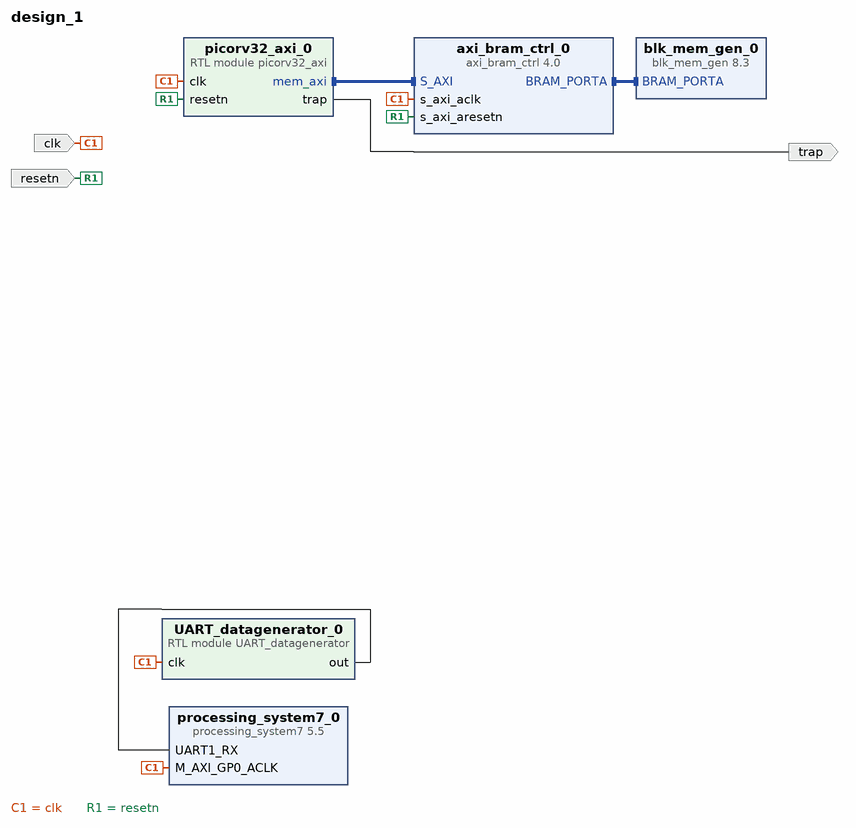
[diagram p0: block diagram of the top level]
# Vivado block design design_1, xc7z020clg484-1, Vivado 2017.2
create_bd_design design_1

create_bd_port -dir I -type clk clk
set_property -dict {CONFIG.FREQ_HZ 100000000} [get_bd_ports clk]
create_bd_port -dir I -type rst resetn
create_bd_port -dir O trap

create_bd_cell -type module -reference picorv32_axi picorv32_axi_0
set_property -dict {CONFIG.ENABLE_IRQ_QREGS 0 CONFIG.ENABLE_IRQ_TIMER 0} [get_bd_cells picorv32_axi_0]
create_bd_cell -type ip -vlnv xilinx.com:ip:blk_mem_gen:8.3 blk_mem_gen_0
set_property -dict [list \
  CONFIG.Enable_32bit_Address false \
  CONFIG.Use_Byte_Write_Enable false \
  CONFIG.Write_Width_A 32 \
  CONFIG.Read_Width_A 32 \
  CONFIG.Register_PortA_Output_of_Memory_Primitives true \
  CONFIG.Use_RSTA_Pin false \
  CONFIG.use_bram_block Stand_Alone \
] [get_bd_cells blk_mem_gen_0]
create_bd_cell -type ip -vlnv xilinx.com:ip:axi_bram_ctrl:4.0 axi_bram_ctrl_0
set_property -dict {CONFIG.PROTOCOL AXI4LITE CONFIG.SINGLE_PORT_BRAM 1} [get_bd_cells axi_bram_ctrl_0]
create_bd_cell -type ip -vlnv xilinx.com:ip:processing_system7:5.5 processing_system7_0
set_property -dict {CONFIG.PCW_UART1_PERIPHERAL_ENABLE 1 CONFIG.PCW_UART1_UART1_IO EMIO} [get_bd_cells processing_system7_0]
# 1 more settings of processing_system7_0 are not shown: defaults, MIO pin electricals, DDR timing, and values the tool derives
create_bd_cell -type module -reference UART_datagenerator UART_datagenerator_0

# ---- connections ----

connect_bd_intf_net [get_bd_intf_pins axi_bram_ctrl_0/BRAM_PORTA] [get_bd_intf_pins blk_mem_gen_0/BRAM_PORTA]
connect_bd_intf_net [get_bd_intf_pins axi_bram_ctrl_0/S_AXI] [get_bd_intf_pins picorv32_axi_0/mem_axi]
connect_bd_net [get_bd_ports clk] \
  [get_bd_pins picorv32_axi_0/clk] [get_bd_pins axi_bram_ctrl_0/s_axi_aclk] [get_bd_pins processing_system7_0/M_AXI_GP0_ACLK] \
  [get_bd_pins UART_datagenerator_0/clk]
connect_bd_net [get_bd_ports resetn] [get_bd_pins axi_bram_ctrl_0/s_axi_aresetn] [get_bd_pins picorv32_axi_0/resetn]
connect_bd_net [get_bd_pins picorv32_axi_0/trap] [get_bd_ports trap]
connect_bd_net [get_bd_pins UART_datagenerator_0/out] [get_bd_pins processing_system7_0/UART1_RX]

validate_bd_design
save_bd_design
